# EAGLE design Project_Czepil_Zwolinska_1 (EAGLE 9.2.2)
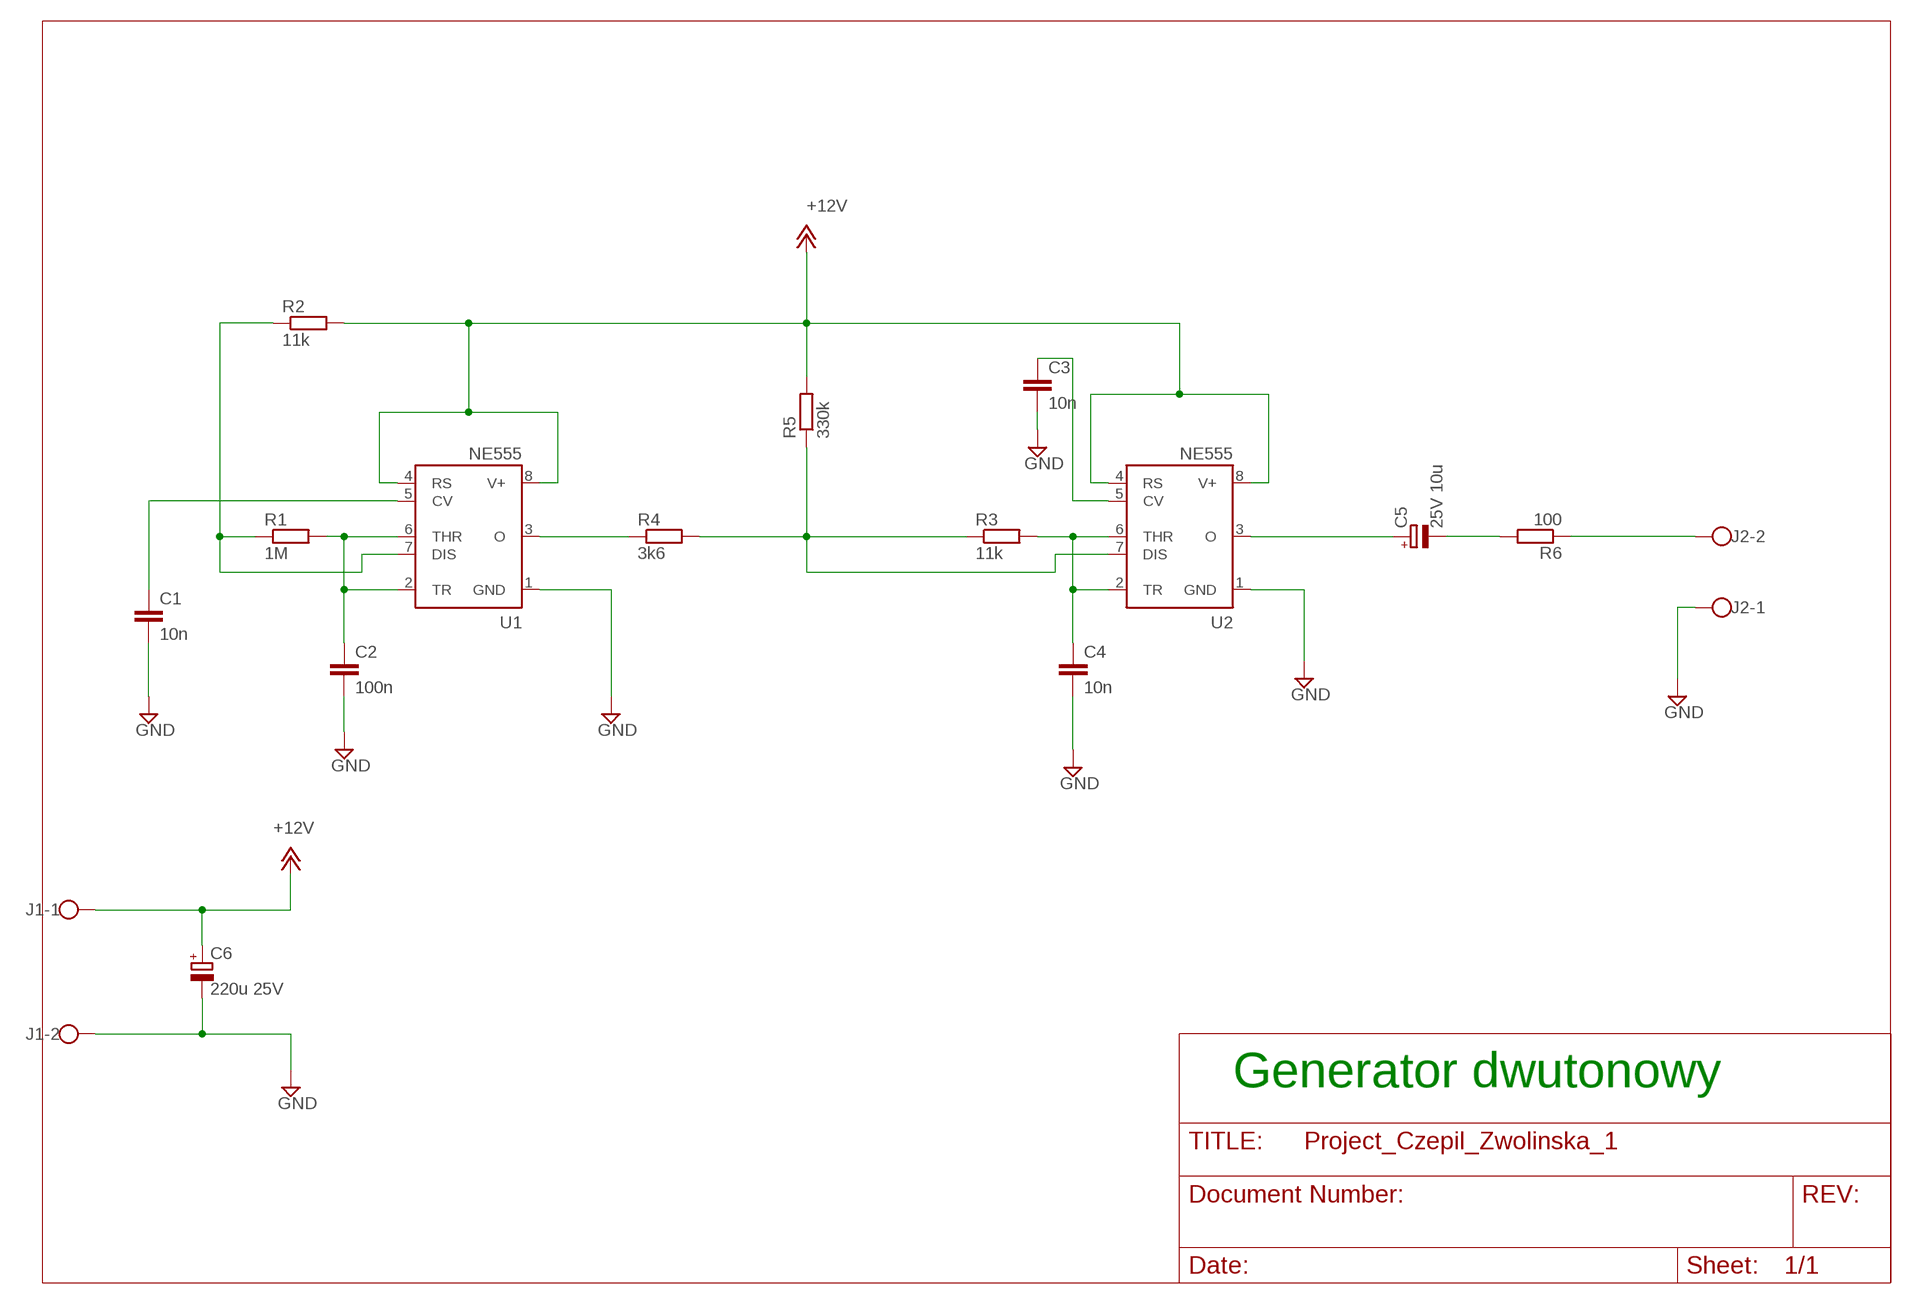
[diagram p0: schematic, sheet 1]

## Parts
C1  10n  C-EUC1206  [C1206]
C2  100n  C-EUC1206  [C1206]
C3  10n  C-EUC1206  [C1206]
C4  10n  C-EUC1206  [C1206]
C5  25V 10u  CPOL-EUE1.8-4  [E1,8-4]
C6  220u 25V  CPOL-EUE2-4  [E2-4]
J1  W237-102  [W237-102]
J2  W237-102  [W237-102]
R1  1M  R-EU_0207/10  [0207/10]
R2  11k  R-EU_0207/10  [0207/10]
R3  11k  R-EU_0207/10  [0207/10]
R4  3k6  R-EU_0207/10  [0207/10]
R5  330k  R-EU_0207/10  [0207/10]
R6  100  R-EU_0207/10  [0207/10]
U1  NE555  [DIL-08]
U2  NE555  [DIL-08]

## Nets
+12V: C6.+ J1.1 R2.2 R5.2 U1.4(RS) U1.8(V+) U2.4(RS) U2.8(V+)
GND: C1.2 C2.2 C3.2 C4.2 C6.- J1.2 J2.1 U1.1(GND) U2.1(GND)
N$1: J2.2 R6.1
N$2: C5.- R6.2
N$3: R3.1 R4.2 R5.1 U2.7(DIS)
N$4: C1.1 U1.5(CV)
N$5: R1.1 R2.1 U1.7(DIS)
N$6: C2.1 R1.2 U1.2(TR) U1.6(THR)
N$8: C3.1 U2.5(CV)
N$9: C5.+ U2.3(O)
N$10: C4.1 R3.2 U2.2(TR) U2.6(THR)
N$12: R4.1 U1.3(O)

## Notes on the sheet
- Generator dwutonowy

## Library data of the parts
C1-C4 = rcl:C-EU: CAPACITOR, European symbol; SPICEPREFIX: C
C5 C6 = rcl:CPOL-EU: POLARIZED CAPACITOR, European symbol; SPICEPREFIX: C
J1 J2 = con-wago-500:W237-102: WAGO SCREW CLAMP; MPN: 237-102; OC_FARNELL: unknown; OC_NEWARK: 70K9898
R1-R6 = rcl:R-EU_: RESISTOR, European symbol; SPICEPREFIX: R
U1 U2 = Projekt_123:NE555: General purpose bipolar Timer; MF: Arrow Electronics; MPN: NE555N; OC_FARNELL: 1467742; OC_NEWARK: 89K1486

## Board
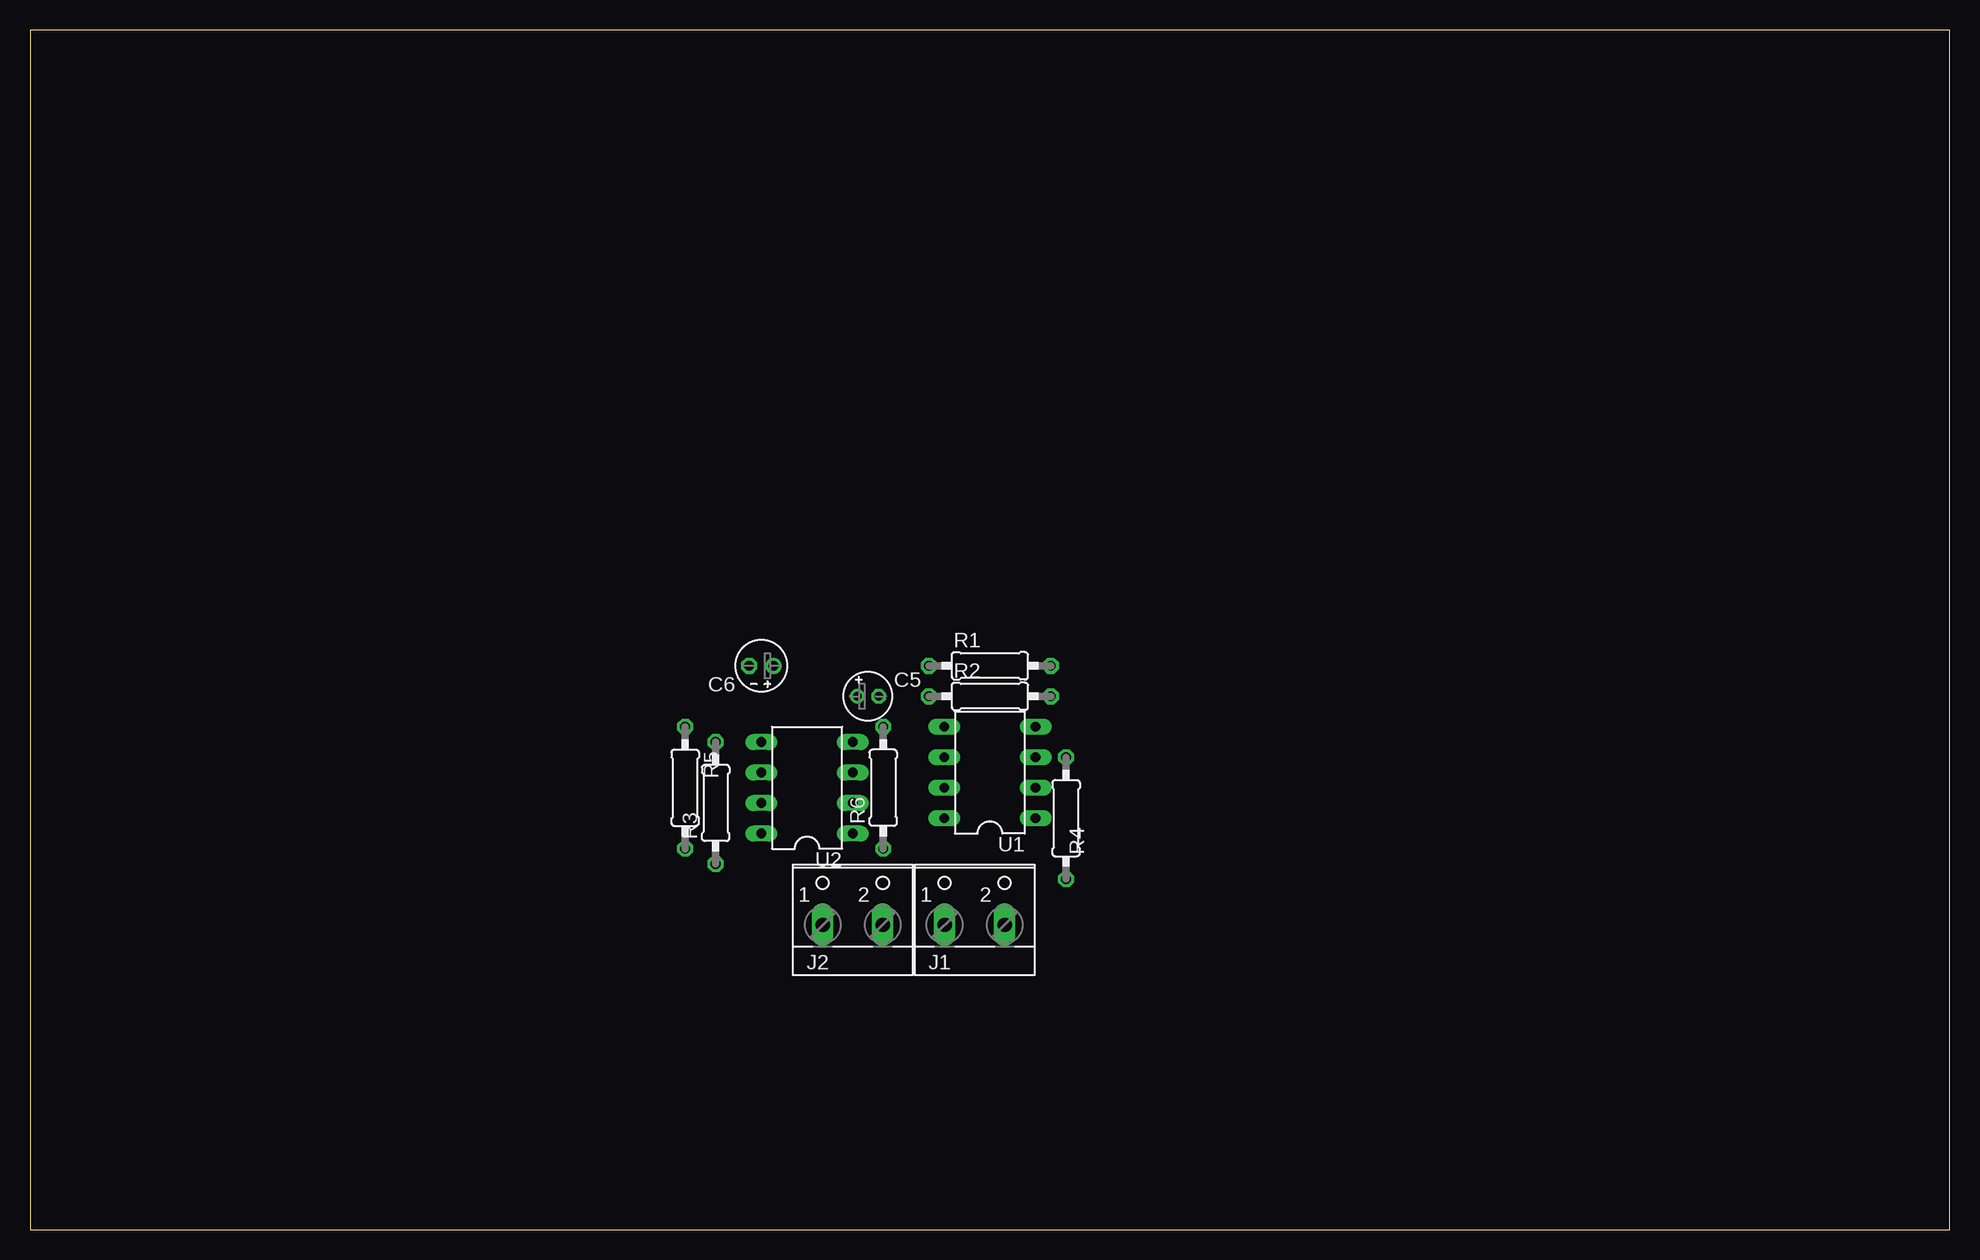
[diagram p1: board, top side]
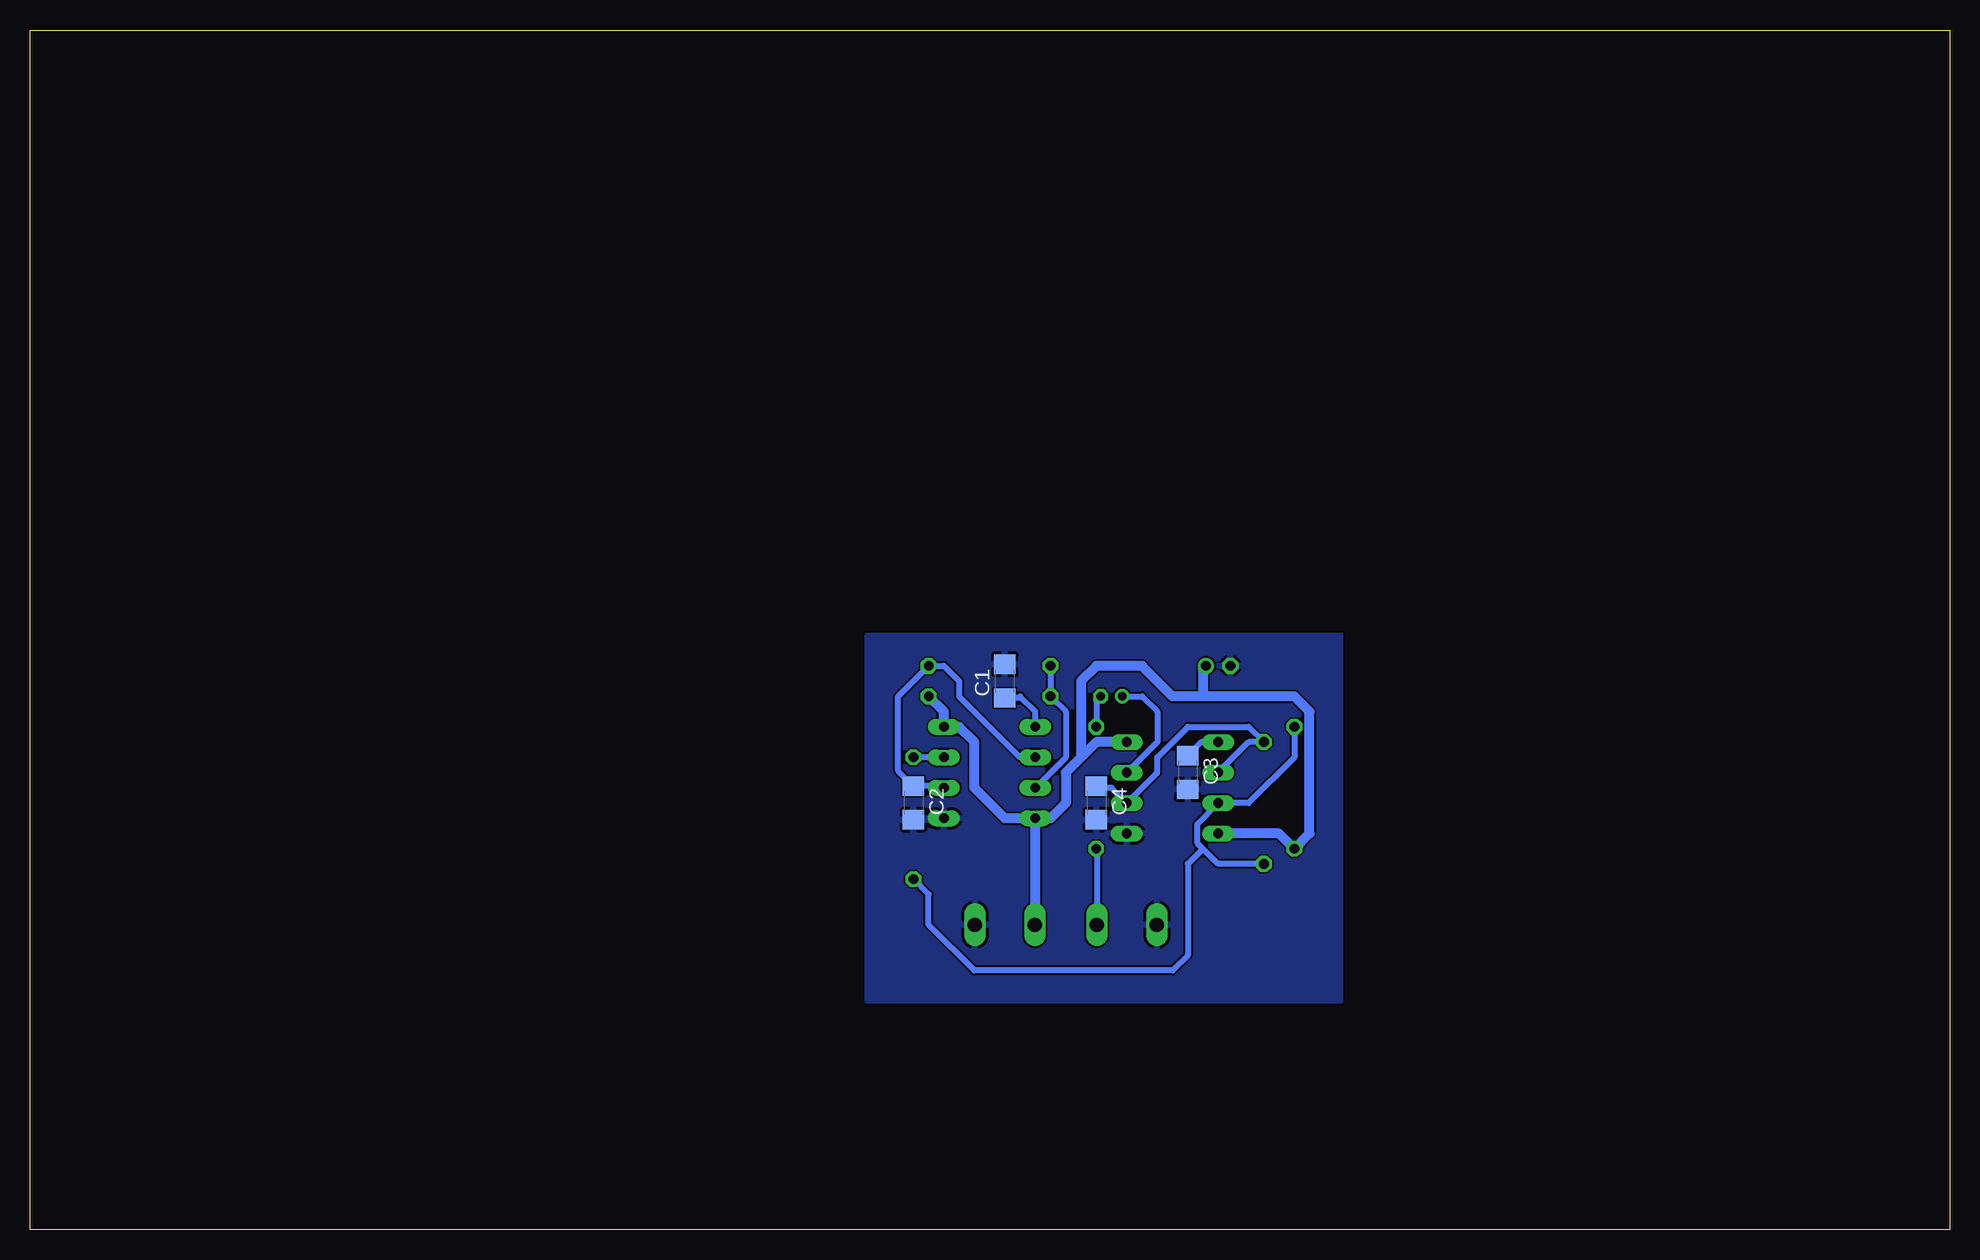
[diagram p2: board, bottom side, seen from below]

Size 160 x 100 mm. Coordinates in mm from the lower left corner, seen from the top.
Outline: 0,0 160,0 160,100 0,100 0,0
Copper layers (1*16): Top 0.035mm / dielectric 1.5mm / Bottom 0.035mm
Design rules "default": minimum track width 6mil, minimum drill 0.35mm, track to track 6mil, track to pad 6mil, pad to pad 6mil, via to via 6mil, smd to smd 6mil, copper to edge 40mil, drill to drill 6mil, minimum pad ring 10mil, minimum via ring 8mil, stop-mask expansion 4mil, vias tented up to drill 0mil, thermal gap 10mil

### Footprints (pad centres in the part's own frame; a part is rotated, then mirrored left to right if it is on the bottom)
C1206 = smd 1.6 x 1.8: 1 -1.4,0; 2 1.4,0
E1,8-4 = drill 0.711 pad 1.168: + -0.889,0 | drill 0.711 pad 1.168 octagon: - 0.889,0
E2-4 = drill 0.813 pad 1.27: + -1.016,0 | drill 0.813 pad 1.27 octagon: - 1.016,0
W237-102 = drill 1.194 long: 1 -2.5,-1.27; 2 2.5,-1.27
0207/10 = drill 0.813 octagon: 1 -5.08,0; 2 5.08,0
DIL-08 = drill 0.813 long: 1 -3.81,-3.81; 2 -1.27,-3.81; 3 1.27,-3.81; 4 3.81,-3.81; 5 3.81,3.81; 6 1.27,3.81; 7 -1.27,3.81; 8 -3.81,3.81

### Placement (x,y rotation side)
C1  78.74,45.72 90 bottom
C2  86.36,35.56 270 bottom
C3  63.5,38.1 270 bottom
C4  71.12,35.56 270 bottom
C5  69.85,44.45 0 top
C6  60.96,46.99 180 top
J1  78.74,26.67 0 top
J2  68.58,26.67 0 top
R1  80.01,46.99 0 top
R2  80.01,44.45 0 top
R3  57.15,35.56 90 top
R4  86.36,34.29 270 top
R5  54.61,36.83 270 top
R6  71.12,36.83 90 top
U1  80.01,38.1 90 top
U2  64.77,36.83 90 top

### Tracks (layer width: path | path; a pad name or v marks a point on that pad's centre or on a via)
+12V
  Bottom 0.813: U1.8 78.74,34.29 81.28,36.83 81.28,40.64 82.55,41.91 U1.4 83.82,43.18 R2.2 | U1.8 76.24,34.25 | U2.4 71.12,40.64 72.39,39.37 | 72.39,39.37 73.66,38.1 73.66,35.56 74.93,34.29 U1.8 | 72.39,39.37 72.39,45.72 71.12,46.99 67.31,46.99 64.77,44.45 62.23,44.45 | 62.23,44.45 54.61,44.45 53.34,43.18 53.34,33.02 R5.2 55.88,33.02 U2.8 | C6.+ 62.23,46.74 62.23,44.45 | J1.1 76.2,25.44 U1.8
GND
  pour Bottom: 50.8,49.53 50.8,19.05 90.17,19.05 90.17,49.53
N$1
  Bottom 0.508: R6.1 71.08,31.71 J2.2
N$2
  Bottom 0.508: C5.- 71.12,44.07 R6.2
N$3
  Bottom 0.508: R5.1 54.61,39.37 58.42,35.56 U2.7 62.69,33.83 62.69,32.21 62.23,31.75 | R3.1 60.96,30.48 62.23,31.75 | 62.23,31.75 63.5,30.48 63.5,22.86 64.77,21.59 81.28,21.59 85.09,25.4 85.09,27.94 R4.2
N$4
  Bottom 0.508: U1.5 76.2,43.18 77.47,44.45 77.6,44.32 C1.1
N$5
  Bottom 0.508: R1.1 R2.1 73.66,43.18 73.66,39.37 U1.7
N$6
  Bottom 0.508: U1.6 77.47,39.37 82.55,44.45 82.55,45.72 83.82,46.99 R1.2 87.63,44.45 87.63,38.23 C2.1 83.95,36.96 U1.2
N$8
  Bottom 0.508: U2.5 62.36,40.64 C3.1
N$9
  Bottom 0.508: C5.+ 67.31,44.45 66.04,43.18 66.04,40.64 U2.3
N$10
  Bottom 0.508: U2.6 58.42,40.64 R3.2 58.42,41.91 63.5,41.91 66.04,39.37 66.04,38.1 U2.2 69.85,36.83 70.99,36.83 C4.1
N$12
  Bottom 0.508: U1.3 R4.1